# EAGLE schematic shield_template (EAGLE 7.5.0)
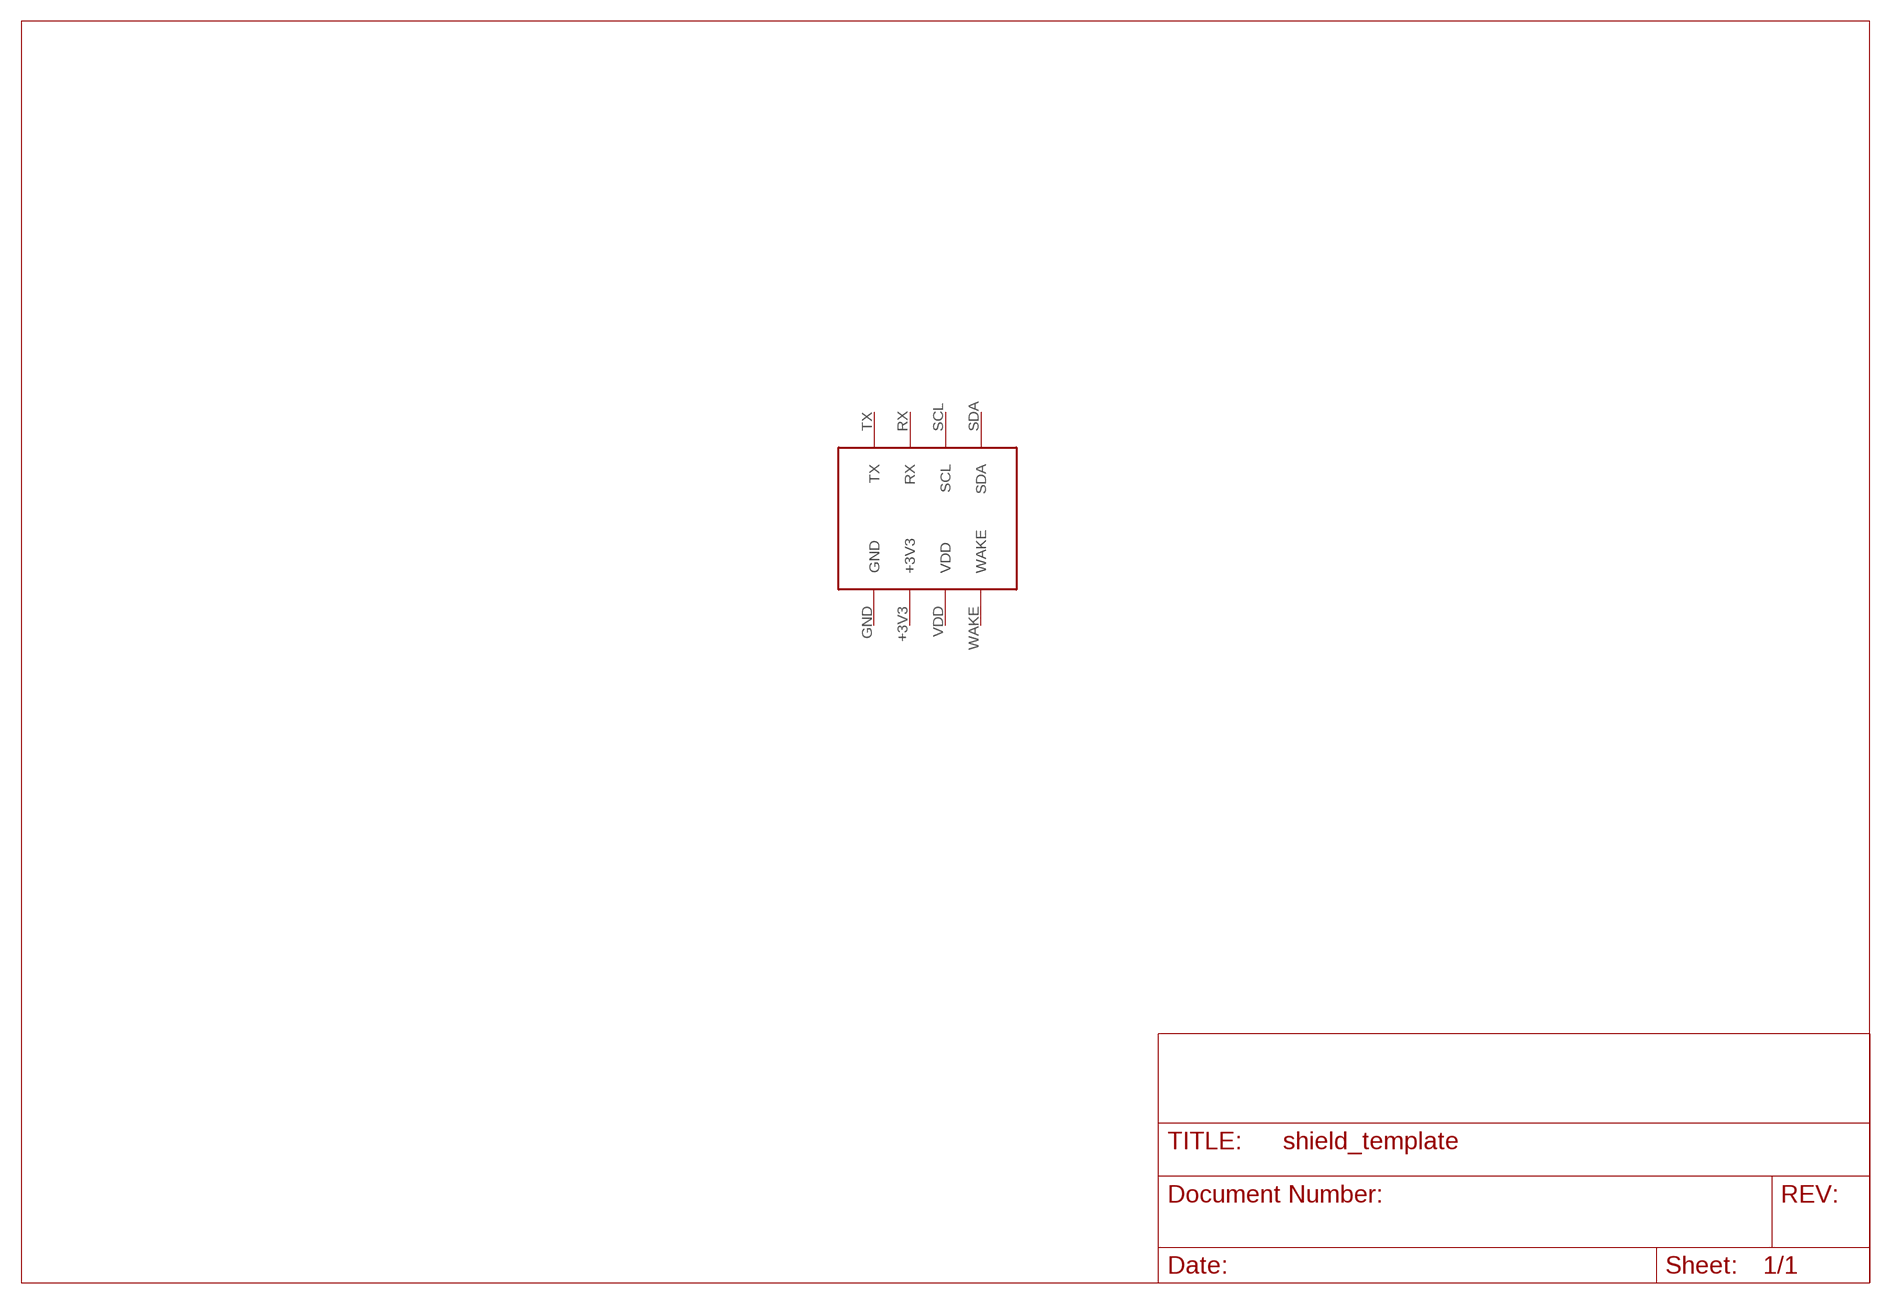
[diagram p0: schematic, sheet 1]

## Parts
U$1  SHIELD  [SHIELD]
Unconnected: U$1.RX U$1.SCL U$1.SDA U$1.TX U$1.WAKE

## Power pins joined to a net without a drawn wire
+3V3: U$1.+3V3
GND: U$1.GND
VDD: U$1.VDD

## Library data of the parts
U$1 = balance:SHIELD

## Net classes
0 default: clearance 0.205 mm